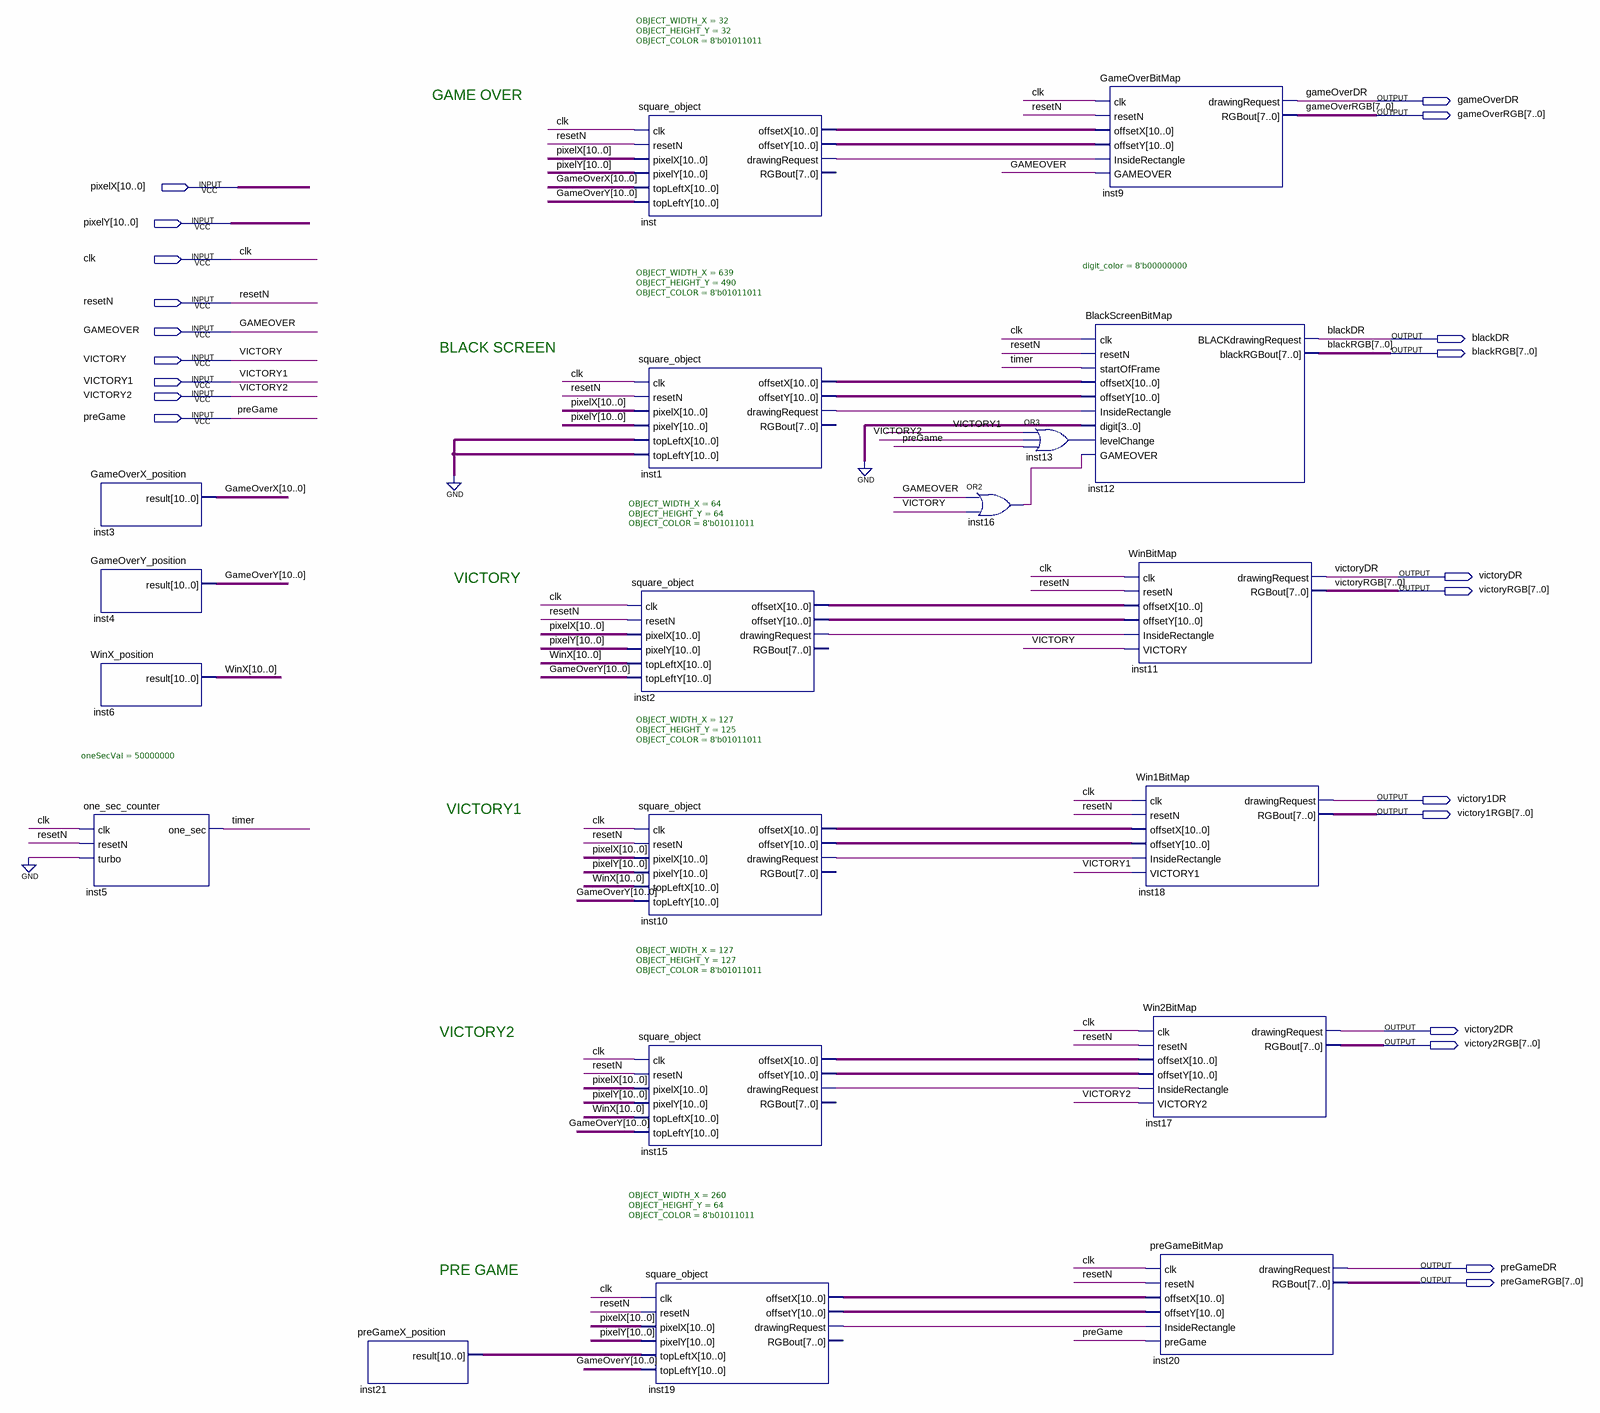
[diagram p0: schematic sheet]
// Quartus schematic EndGame_Block_T.bdf as structural Verilog: 19 symbols, 21 pins
module EndGame_Block_T (
  input  [10:0] pixelX,
  input  [10:0] pixelY,
  input  clk,
  input  resetN,
  input  GAMEOVER,
  input  VICTORY,
  input  VICTORY1,
  input  VICTORY2,
  input  preGame,
  output gameOverDR,
  output [7:0] gameOverRGB,
  output blackDR,
  output [7:0] blackRGB,
  output victoryDR,
  output [7:0] victoryRGB,
  output victory1DR,
  output [7:0] victory1RGB,
  output victory2DR,
  output [7:0] victory2RGB,
  output preGameDR,
  output [7:0] preGameRGB
);

  wire inst1_drawingrequest, inst2_drawingrequest, inst10_drawingrequest, inst13_out, inst15_drawingrequest,
       inst16_out, inst19_drawingrequest, inst_drawingrequest, timer;
  wire [10:0] GameOverX, GameOverY, inst1_offsetx, inst1_offsety, inst2_offsetx, inst2_offsety,
       inst10_offsetx, inst10_offsety, inst15_offsetx, inst15_offsety, inst19_offsetx, inst19_offsety,
       inst21_result, inst_offsetx, inst_offsety, WinX;

  GameOverX_position inst3 (.result(GameOverX));
  GameOverY_position inst4 (.result(GameOverY));
  WinX_position inst6 (.result(WinX));
  one_sec_counter #(.oneSecVal(50000000)) inst5 (.clk(clk), .resetN(resetN), .turbo(1'b0), .one_sec(timer));
  preGameX_position inst21 (.result(inst21_result));
  square_object #(.OBJECT_WIDTH_X(32), .OBJECT_HEIGHT_Y(32), .OBJECT_COLOR(8'b01011011)) inst (
    .clk(clk), .resetN(resetN), .pixelX(pixelX), .pixelY(pixelY), .topLeftX(GameOverX), .topLeftY(GameOverY),
    .offsetX(inst_offsetx), .offsetY(inst_offsety), .drawingRequest(inst_drawingrequest));  // open: RGBout
  square_object #(.OBJECT_WIDTH_X(639), .OBJECT_HEIGHT_Y(490), .OBJECT_COLOR(8'b01011011)) inst1 (
    .clk(clk), .resetN(resetN), .pixelX(pixelX), .pixelY(pixelY), .topLeftX({11{1'b0}}),
    .topLeftY({11{1'b0}}), .offsetX(inst1_offsetx), .offsetY(inst1_offsety),
    .drawingRequest(inst1_drawingrequest));  // open: RGBout
  square_object #(.OBJECT_WIDTH_X(64), .OBJECT_HEIGHT_Y(64), .OBJECT_COLOR(8'b01011011)) inst2 (
    .clk(clk), .resetN(resetN), .pixelX(pixelX), .pixelY(pixelY), .topLeftX(WinX), .topLeftY(GameOverY),
    .offsetX(inst2_offsetx), .offsetY(inst2_offsety), .drawingRequest(inst2_drawingrequest));  // open: RGBout
  square_object #(.OBJECT_WIDTH_X(127), .OBJECT_HEIGHT_Y(125), .OBJECT_COLOR(8'b01011011)) inst10 (
    .clk(clk), .resetN(resetN), .pixelX(pixelX), .pixelY(pixelY), .topLeftX(WinX), .topLeftY(GameOverY),
    .offsetX(inst10_offsetx), .offsetY(inst10_offsety), .drawingRequest(inst10_drawingrequest));  // open: RGBout
  square_object #(.OBJECT_WIDTH_X(127), .OBJECT_HEIGHT_Y(127), .OBJECT_COLOR(8'b01011011)) inst15 (
    .clk(clk), .resetN(resetN), .pixelX(pixelX), .pixelY(pixelY), .topLeftX(WinX), .topLeftY(GameOverY),
    .offsetX(inst15_offsetx), .offsetY(inst15_offsety), .drawingRequest(inst15_drawingrequest));  // open: RGBout
  square_object #(.OBJECT_WIDTH_X(260), .OBJECT_HEIGHT_Y(64), .OBJECT_COLOR(8'b01011011)) inst19 (
    .clk(clk), .resetN(resetN), .pixelX(pixelX), .pixelY(pixelY), .topLeftX(inst21_result),
    .topLeftY(GameOverY), .offsetX(inst19_offsetx), .offsetY(inst19_offsety),
    .drawingRequest(inst19_drawingrequest));  // open: RGBout
  or inst16 (inst16_out, GAMEOVER, VICTORY);
  or inst13 (inst13_out, VICTORY1, VICTORY2, preGame);
  GameOverBitMap inst9 (
    .clk(clk), .resetN(resetN), .offsetX(inst_offsetx), .offsetY(inst_offsety),
    .InsideRectangle(inst_drawingrequest), .GAMEOVER(GAMEOVER), .drawingRequest(gameOverDR),
    .RGBout(gameOverRGB));
  BlackScreenBitMap #(.digit_color(8'b00000000)) inst12 (
    .clk(clk), .resetN(resetN), .startOfFrame(timer), .offsetX(inst1_offsetx), .offsetY(inst1_offsety),
    .InsideRectangle(inst1_drawingrequest), .digit(4'b0000), .levelChange(inst13_out), .GAMEOVER(inst16_out),
    .BLACKdrawingRequest(blackDR), .blackRGBout(blackRGB));
  WinBitMap inst11 (
    .clk(clk), .resetN(resetN), .offsetX(inst2_offsetx), .offsetY(inst2_offsety),
    .InsideRectangle(inst2_drawingrequest), .VICTORY(VICTORY), .drawingRequest(victoryDR), .RGBout(victoryRGB));
  Win1BitMap inst18 (
    .clk(clk), .resetN(resetN), .offsetX(inst10_offsetx), .offsetY(inst10_offsety),
    .InsideRectangle(inst10_drawingrequest), .VICTORY1(VICTORY1), .drawingRequest(victory1DR),
    .RGBout(victory1RGB));
  Win2BitMap inst17 (
    .clk(clk), .resetN(resetN), .offsetX(inst15_offsetx), .offsetY(inst15_offsety),
    .InsideRectangle(inst15_drawingrequest), .VICTORY2(VICTORY2), .drawingRequest(victory2DR),
    .RGBout(victory2RGB));
  preGameBitMap inst20 (
    .clk(clk), .resetN(resetN), .offsetX(inst19_offsetx), .offsetY(inst19_offsety),
    .InsideRectangle(inst19_drawingrequest), .preGame(preGame), .drawingRequest(preGameDR),
    .RGBout(preGameRGB));

  // Notes on the sheet:
  //   GAME OVER
  //   BLACK SCREEN
  //   VICTORY
  //   VICTORY1
  //   VICTORY2
  //   PRE GAME
endmodule
